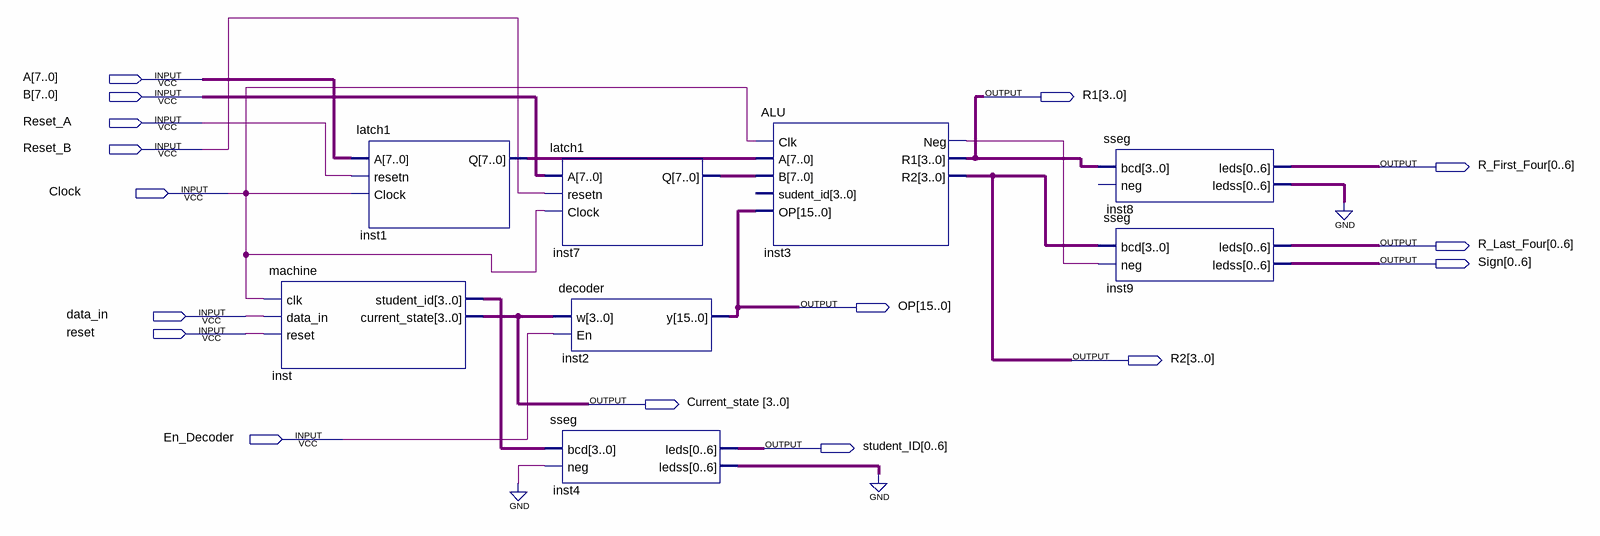
[diagram p0: schematic sheet]
// Quartus schematic FinalCircuit.bdf as structural Verilog: 8 symbols, 16 pins
module FinalCircuit (
  input  [7:0] A,
  input  [7:0] B,
  input  Reset_A,
  input  Reset_B,
  input  Clock,
  input  data_in,
  input  reset,
  input  En_Decoder,
  output [3:0] R1,
  output [0:6] R_First_Four,
  output [0:6] R_Last_Four,
  output [0:6] Sign,
  output [15:0] OP,
  output [3:0] R2,
  output [3:0] Current_state,
  output [0:6] student_ID
);

  wire inst3_neg;
  wire [3:0] inst_student_id;
  wire [6:0] inst4_ledss, inst8_ledss;
  wire [7:0] inst1_q, inst7_q;

  machine inst (
    .clk(Clock), .data_in(data_in), .reset(reset), .student_id(inst_student_id), .current_state(Current_state));
  latch1 inst1 (.A(A), .resetn(Reset_A), .Clock(Clock), .Q(inst1_q));
  latch1 inst7 (.A(B), .resetn(Reset_B), .Clock(Clock), .Q(inst7_q));
  sseg inst4 (.bcd(inst_student_id), .neg(1'b0), .leds(student_ID), .ledss(inst4_ledss));
  decoder inst2 (.w(Current_state), .En(En_Decoder), .y(OP));
  ALU inst3 (.Clk(Clock), .A(inst1_q), .B(inst7_q), .OP(OP), .Neg(inst3_neg), .R1(R1), .R2(R2));  // open: sudent_id
  sseg inst8 (.bcd(R1), .leds(R_First_Four), .ledss(inst8_ledss));  // open: neg
  sseg inst9 (.bcd(R2), .neg(inst3_neg), .leds(R_Last_Four), .ledss(Sign));
  // also tied to GND on the sheet: {inst4_ledss[0], inst4_ledss[1], inst4_ledss[2], inst4_ledss[3], inst4_ledss[4], inst4_ledss[5], inst4_ledss[6], inst8_ledss[0], inst8_ledss[1], inst8_ledss[2], inst8_ledss[3], inst8_ledss[4], inst8_ledss[5], inst8_ledss[6]}
endmodule
